# EAGLE schematic printerInterface 01 (EAGLE 5.03)
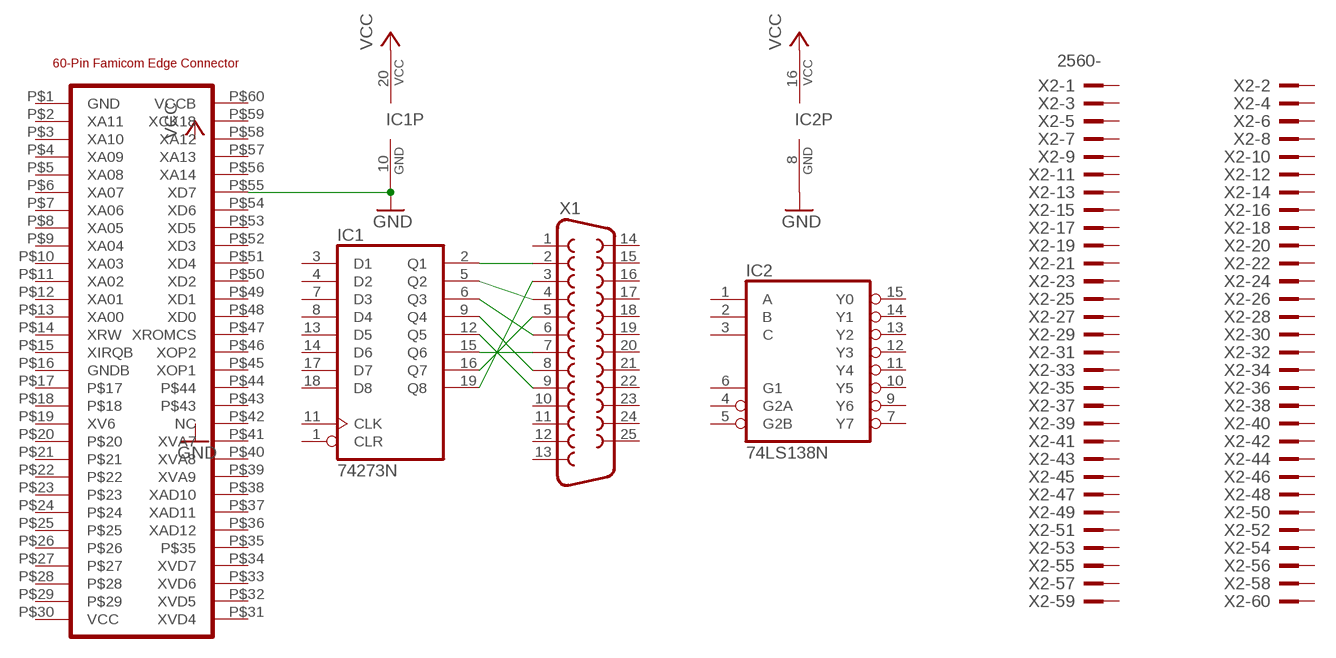
[diagram p0: schematic, sheet 1]

## Parts
IC1  74273N  [DIL20]
IC2  74LS138N  [DIL16]
U$1  CART  [CART]
X1  F25HP  [F25HP]
X2  2560-  [PAK100/2500-60]

## Nets
GND: IC1.10(GND) IC2.8(GND) U$1.P$55(XD7)
N$1: IC1.2(Q1) X1.2
N$2: IC1.5(Q2) X1.4
N$3: IC1.6(Q3) X1.6
N$4: IC1.9(Q4) X1.8
N$5: IC1.12(Q5) X1.9
N$6: IC1.15(Q6) X1.7
N$7: IC1.16(Q7) X1.5
N$8: IC1.19(Q8) X1.3
VCC: IC1.20(VCC) IC2.16(VCC)
Unconnected: IC1.1(CLR) IC1.3(D1) IC1.4(D2) IC1.7(D3) IC1.8(D4) IC1.11(CLK) IC1.13(D5) IC1.14(D6) IC1.17(D7) IC1.18(D8) IC2.1(A) IC2.2(B) IC2.3(C) IC2.4(G2A) IC2.5(G2B) IC2.6(G1) IC2.7(Y7) IC2.9(Y6) IC2.10(Y5) IC2.11(Y4) IC2.12(Y3) IC2.13(Y2) IC2.14(Y1) IC2.15(Y0) U$1.P$1(GND) U$1.P$2(XA11) U$1.P$3(XA10) U$1.P$4(XA09) U$1.P$5(XA08) U$1.P$6(XA07) U$1.P$7(XA06) U$1.P$8(XA05) U$1.P$9(XA04) U$1.P$10(XA03) U$1.P$11(XA02) U$1.P$12(XA01) U$1.P$13(XA00) U$1.P$14(XRW) U$1.P$15(XIRQB) U$1.P$16(GNDB) U$1.P$17 U$1.P$18 U$1.P$19(XV6) U$1.P$20 U$1.P$21 U$1.P$22 U$1.P$23 U$1.P$24 U$1.P$25 U$1.P$26 U$1.P$27 U$1.P$28 U$1.P$29 U$1.P$30(VCC) U$1.P$31(XVD4) U$1.P$32(XVD5) U$1.P$33(XVD6) U$1.P$34(XVD7) U$1.P$35 U$1.P$36(XAD12) U$1.P$37(XAD11) U$1.P$38(XAD10) U$1.P$39(XVA9) U$1.P$40(XVA8) U$1.P$41(XVA7) U$1.P$42(NC) U$1.P$43 U$1.P$44 U$1.P$45(XOP1) U$1.P$46(XOP2) U$1.P$47(XROMCS) U$1.P$48(XD0) U$1.P$49(XD1) U$1.P$50(XD2) U$1.P$51(XD4) U$1.P$52(XD3) U$1.P$53(XD5) U$1.P$54(XD6) U$1.P$56(XA14) U$1.P$57(XA13) U$1.P$58(XA12) U$1.P$59(XCK18) U$1.P$60(VCCB) X1.1 X1.10 X1.11 X1.12 X1.13 X1.14 X1.15 X1.16 X1.17 X1.18 X1.19 X1.20 X1.21 X1.22 X1.23 X1.24 X1.25 X2.1 X2.2 X2.3 X2.4 X2.5 X2.6 X2.7 X2.8 X2.9 X2.10 X2.11 X2.12 X2.13 X2.14 X2.15 X2.16 X2.17 X2.18 X2.19 X2.20 X2.21 X2.22 X2.23 X2.24 X2.25 X2.26 X2.27 X2.28 X2.29 X2.30 X2.31 X2.32 X2.33 X2.34 X2.35 X2.36 X2.37 X2.38 X2.39 X2.40 X2.41 X2.42 X2.43 X2.44 X2.45 X2.46 X2.47 X2.48 X2.49 X2.50 X2.51 X2.52 X2.53 X2.54 X2.55 X2.56 X2.57 X2.58 X2.59 X2.60

## Library data of the parts
IC1 = 74xx-us:74*273: Octal D type FLIP FLOP, clear
IC2 = 74xx-us:74*138: 3-line to 8-line DECODER/DEMULTIPLEXER
U$1 = playpower:CART
X1 = con-subd:F25: SUB-D
X2 = con-3m:2560-: 3M (TM) Pak 100 4-Wall Header Source: 3M